# Altium schematic sheet Sheet2.1.SchDoc
size 508 x 254 mm
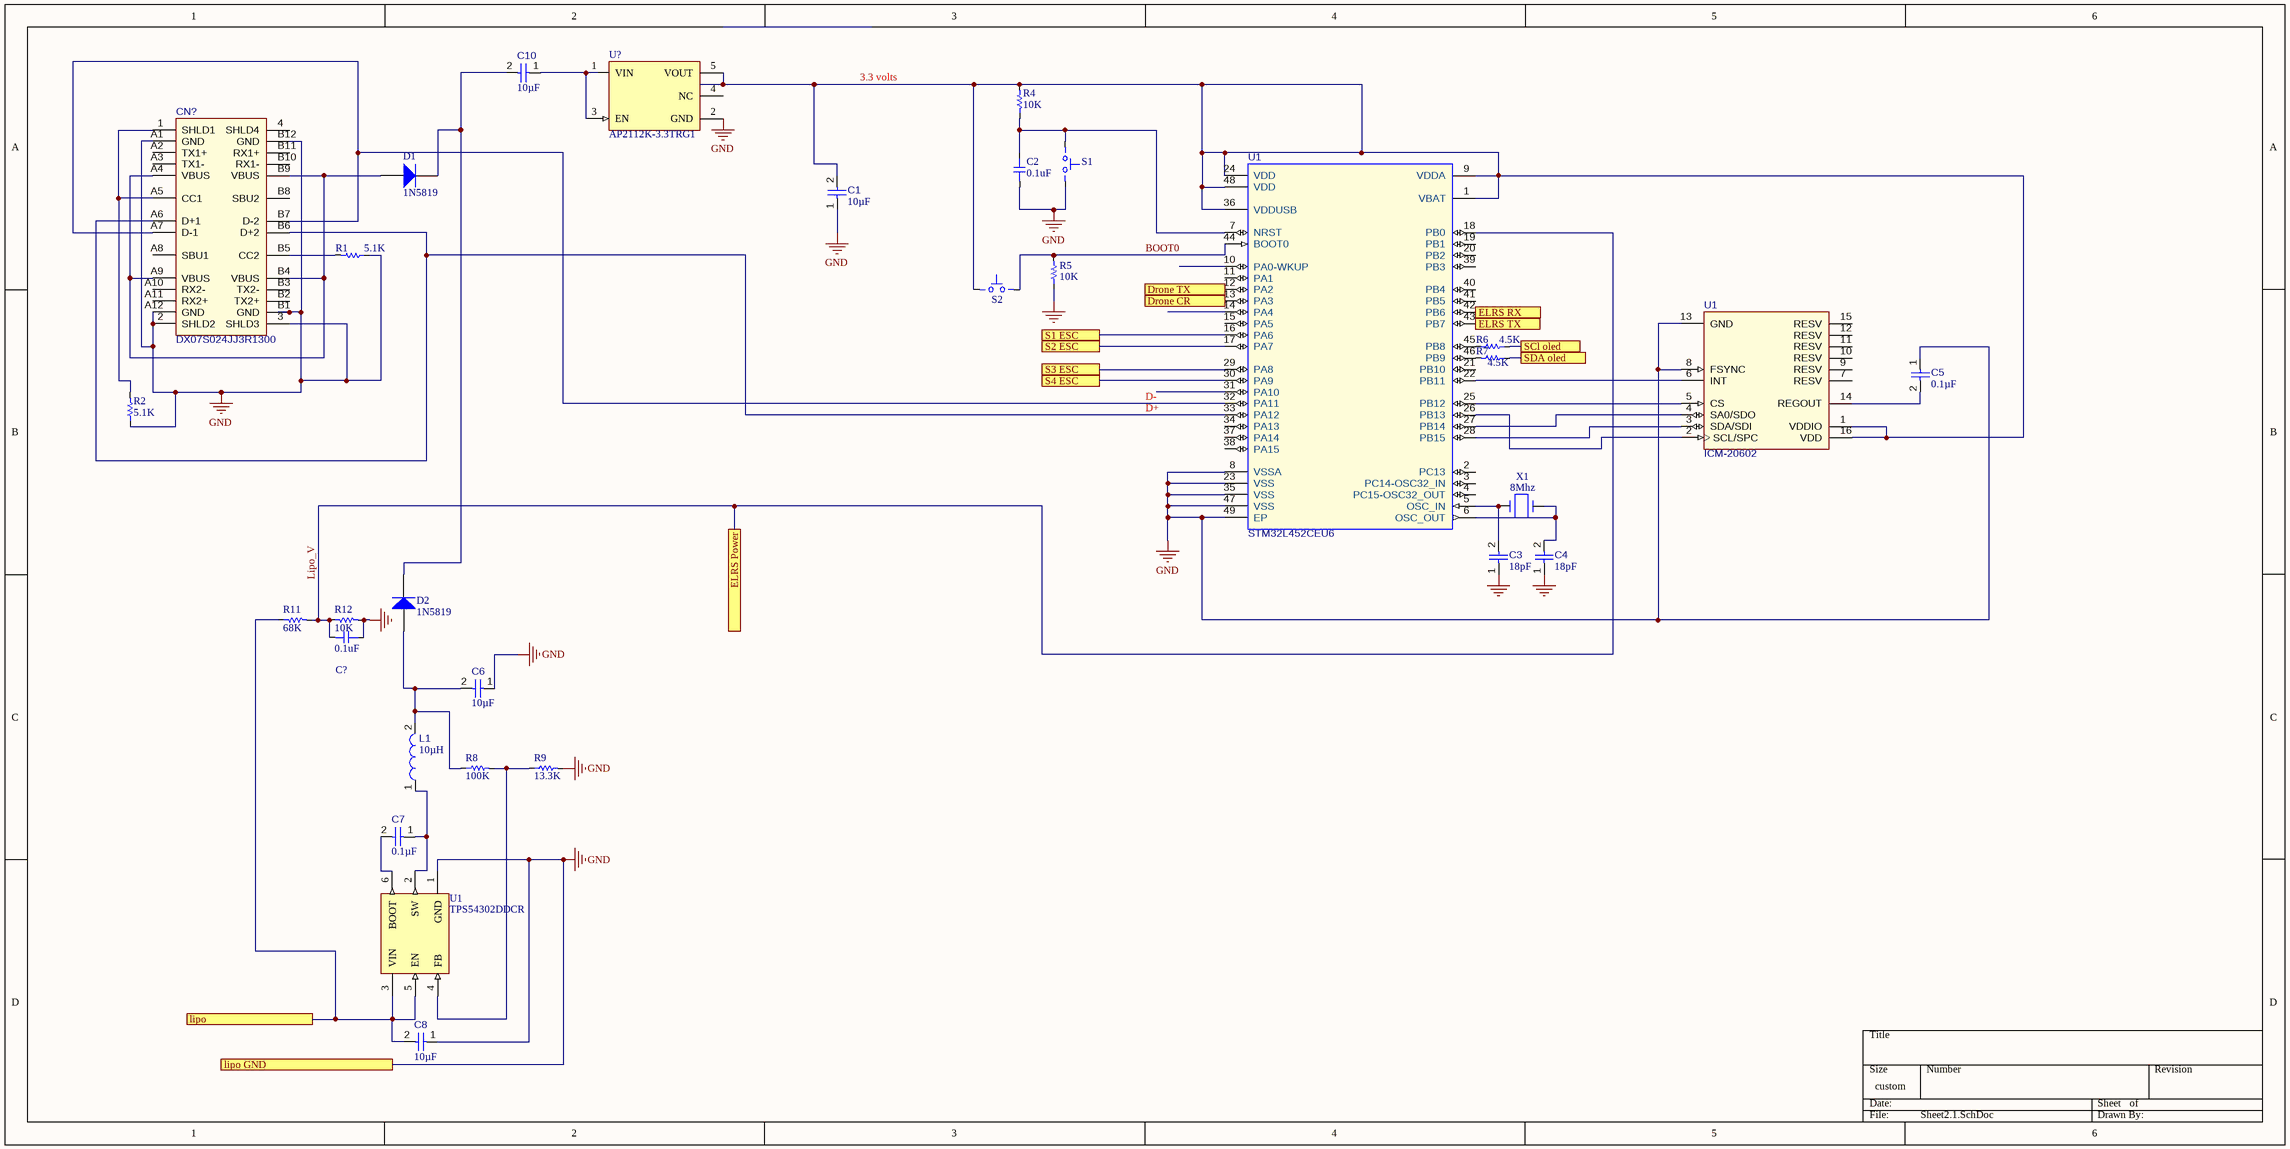
[diagram p0: Sheet2.1.SchDoc]

## Parts
(Parts that share a designator on the sheet are numbered #1, #2 ... from top to bottom, then left to right.)
C1  value 10µF  [CAPC0805(2012)145_L]  (hidden comment: Capacitor 10µF +/-20% 25V 0805)
C2  0.1uF  [CAPC1005X56N]
C3  value 18pF  [CAPC0805(2012)145_L]  (hidden comment: Capacitor 10µF +/-20% 25V 0805)
C4  value 18pF  [CAPC0805(2012)145_L]  (hidden comment: Capacitor 10µF +/-20% 25V 0805)
C5  value 0.1µF  [CAPC0805(2012)145_L]  (hidden comment: Capacitor 10µF +/-20% 25V 0805)
C6  value 10µF  [CAPC0805(2012)145_L]  (hidden comment: Capacitor 10µF +/-20% 25V 0805)
C7  value 0.1µF  [CAPC0805(2012)145_L]  (hidden comment: Capacitor 10µF +/-20% 25V 0805)
C8  value 10µF  [CAPC0805(2012)145_L]  (hidden comment: Capacitor 10µF +/-20% 25V 0805)
C10  value 10µF  [CAPC0805(2012)145_L]  (hidden comment: Capacitor 10µF +/-20% 25V 0805)
C?  0.1uF  [CAPC0603X56N]
CN?  DX07S024JJ3R1300  [JAE-DX07S024JJ3_V]
D1  1N5819  [ONSC-AXIAL_LEAD-2-59-10_P]
D2  1N5819  [ONSC-AXIAL_LEAD-2-59-10_P]
L1  value 10µH  [INDC2520X120X60NL20T20]  (hidden comment: LQM2HPN1R0MJ0L)
R1  5.1K  [RESC0603X40L (0201 footprint)]
R2  5.1K  [RESC0603X40L (0201 footprint)]
R4  10K  [RESC0603X40L (0201 footprint)]
R5  10K  [RESC0603X40L (0201 footprint)]
R6  4.5K  [RESC0603X40L (0201 footprint)]
R7  4.5K  [RESC0603X40L (0201 footprint)]
R8  100K  [RESC0603X40L (0201 footprint)]
R9  13.3K  [RESC0603X40L (0201 footprint)]
R11  68K  [RESC0603X40L (0201 footprint)]
R12  10K  [RESC0603X40L (0201 footprint)]
S1  (no value)  [TS-1088R-02526]
S2  (no value)  [TS-1088R-02526]
U1#1  STM32L452CEU6  [STM-UFQFPN48_N]
U1#2  ICM-20602  [INSE-I62-16]
U1#3  TPS54302DDCR  [FP-DDC0006A-MFG]
U?  AP2112K-3.3TRG1  [FP-SOT25-IPC_A]
X1  8Mhz  [TJXM32768K2TGDCNT2T]

## Ports
Drone CR, Drone TX, ELRS Power, ELRS RX, ELRS TX, lipo , lipo GND, S1 ESC, S2 ESC, S3 ESC, S4 ESC, SCl oled, SDA oled

## Nets
GND: C1.1 C2.1 C3.1 C4.1 C5.1 C6.1 C8.1 C?.2 CN?.2(SHLD2) CN?.3(SHLD3) CN?.A1(GND) CN?.A12(GND) CN?.B1(GND) CN?.B12(GND) R1.2 R2.2 R5.2 R9.1 R12.1 S1.1(A) U1#1.8(VSSA) U1#1.23(VSS) U1#1.35(VSS) U1#1.47(VSS) U1#1.49(EP) U1#2.8(FSYNC) U1#2.13(GND) U1#3.1(GND) U?.2(GND) ; port lipo GND
BOOT0: R5.1 S2.2(B) U1#1.44(BOOT0)
Drone CR: U1#1.13(PA3) ; port Drone CR
Drone TX: U1#1.12(PA2) ; port Drone TX
ELRS RX: U1#1.42(PB6) ; port ELRS RX
ELRS TX: U1#1.43(PB7) ; port ELRS TX
lipo : C8.2 R11.2 U1#3.3(VIN) U1#3.5(EN) ; port lipo 
Lipo_V: C?.1 R11.1 R12.2 U1#1.18(PB0) ; port ELRS Power
S1 ESC: U1#1.16(PA6) ; port S1 ESC
S2 ESC: U1#1.17(PA7) ; port S2 ESC
S3 ESC: U1#1.29(PA8) ; port S3 ESC
S4 ESC: U1#1.30(PA9) ; port S4 ESC
SCl oled: R6.2 ; port SCl oled
SDA oled: R7.2 ; port SDA oled
NetC1_2: C1.2 R4.1 S2.1(A) U1#1.1(VBAT) U1#1.9(VDDA) U1#1.24(VDD) U1#1.36(VDDUSB) U1#1.48(VDD) U1#2.1(VDDIO) U1#2.16(VDD) U?.5(VOUT)
NetC2_2: C2.2 R4.2 S1.2(B) U1#1.7(NRST)
NetC3_2: C3.2 U1#1.5(OSC_IN) X1.1
NetC4_2: C4.2 U1#1.6(OSC_OUT) X1.2
NetC5_2: C5.2 U1#2.14(REGOUT)
NetC6_2: C6.2 D2.1(A) L1.2 R8.2
NetC7_1: C7.1 L1.1 U1#3.2(SW)
NetC7_2: C7.2 U1#3.6(BOOT)
NetC10_1: C10.1 U?.1(VIN) U?.3(EN)
NetC10_2: C10.2 D1.2(K) D2.2(K)
NetCN?_1: CN?.1(SHLD1) CN?.A5(CC1) R2.1
NetCN?_A4: CN?.A4(VBUS) CN?.A9(VBUS) CN?.B4(VBUS) CN?.B9(VBUS) D1.1(A)
NetCN?_A6: CN?.A6(D+1) CN?.B6(D+2) U1#1.33(PA12)
NetCN?_A7: CN?.A7(D-1) CN?.B7(D-2) U1#1.32(PA11)
NetCN?_B5: CN?.B5(CC2) R1.1
NetR6_1: R6.1 U1#1.45(PB8)
NetR7_1: R7.1 U1#1.46(PB9)
NetR8_1: R8.1 R9.2 U1#3.4(FB)
NetU1#1_22: U1#1.22(PB11) U1#2.6(INT)
NetU1#1_25: U1#1.25(PB12) U1#2.5(CS)
NetU1#1_26: U1#1.26(PB13) U1#2.2(SCL/SPC)
NetU1#1_27: U1#1.27(PB14) U1#2.4(SA0/SDO)
NetU1#1_28: U1#1.28(PB15) U1#2.3(SDA/SDI)

Not connected (* = marked no-connect by the designer): CN? 4(SHLD4) A2(TX1+) A3(TX1-) A8(SBU1) A10(RX2-) A11(RX2+) B2(TX2+) B3(TX2-) B8(SBU2) B10(RX1-) B11(RX1+); U1#1 2(PC13) 3(PC14-OSC32_IN) 4(PC15-OSC32_OUT) 10(PA0-WKUP) 11(PA1) 14(PA4) 15(PA5) 19(PB1) 20(PB2) 21(PB10) 31(PA10) 34(PA13) 37(PA14) 38(PA15) 39(PB3) 40(PB4) 41(PB5); U1#2 7(RESV) 9(RESV) 10(RESV) 11(RESV) 12(RESV) 15(RESV); U? 4(NC)

## Notes on the sheet
- 3.3 volts
- D-
- D+

## Library data of the parts
C1 C3-C8 C10 = CMP-001-00079-4: Chip Capacitor, 10µF +/-20%, 25V, 0805, Thickness 1.45 mm; Tolerance: 10%; Max Operating Temperature: 85°C; Case/Package: 0805; Voltage Rating: 25V; Min Operating Temperature: -55°C; Mounting Technology: SMT; Pins: 2
C2 = CAP_0402: CAP 1uF 0402; Part_Footprint: 0402; Value: 0.1uF
C? = CAP_0201: CAP 0.1uF 0201; Part_Footprint: 0201; Value: 0.1uF
CN? = CMP-002-00065-3: USB-C Connector, 20 V, 1.25 A, -30 to 80 degC, RoHS, Tape and Reel; Gender: Receptacle; Pins: 28; Connector Type: USB-C
D1 D2 = CMP-004-00009-2: Low Drop Power Schottky Rectifier, 40 V, 1 A, 2-Pin DO-41, RoHS; Manufacturer: ON Semiconductor; Max Surge Current: 25A; Forward Current: 1A; Package Version: Rev. U, 02/2005; Peak Reverse Current: 1mA; Max Operating Temperature: 125°C; Case/Package: DO; Package URL: http://www.onsemi.cn/pub_link/Collateral/59-10.PDF; Packaging: Bulk; Manufacturer URL: http://www.onsemi.com/; Min Operating Temperature: -65°C; Package Description: 2-Pin, Axial Lead, Diameter 2.35 mm; Mounting Technology: TH; Datasheet URL: http://www.onsemi.cn/pub_link/Collateral/1N5817-D.PDF; Datasheet Version: Rev. 10, 07/2006; Package Reference: AXIAL_LEAD-2-59-10; Pins: 2; RoHS Compliant: True
L1 = CMP-006-00008-6: Chip Inductor, 1 uH, +/- 20%, 1 MHz, -55 to 125 degC, 1008 (2520 Metric), RoHS, Tape and Reel; Manufacturer: Murata; Self Resonant Frequency: 70MHz; Current Rating: 1.5A; Shielding: Shielded; Core Material: Ferrite; Resistance: 0.09Ohm; Datasheet URL: http://psearch.en.murata.com/inductor/product/LQM2HPN1R0MJ0%23.pdf; Datasheet Version: Aug-16; RoHS Compliant: True; Case/Package: 1008; Package Description: 2-Pin Surface Mount Device, Body 2.5 x 2 mm; Package Quantity: 3000; Tolerance: 20%; Min Operating Temperature: -40°C; Package Reference: 1008; Packaging: TapeandReel; Mounting Technology: SM; Max Operating Temperature: 85°C
R1 R2 R4 R6 R7 = RES_0201: RES 10 0201; PartFootprint: 0201
  R1 R2: Value: 5.1K
  R4: Value: 10K
  R6 R7: Value: 4.5K
R5 = RES_0201: RES 10K 0201; PartFootprint: 0201; Value: 10K
R8 R9 R11 = RES_0201: RES 390K 0201; PartFootprint: 0201
  R8: Value: 100K
  R9: Value: 13.3K
  R11: Value: 68K
R12 = RES_0201: RES 1M 0201; PartFootprint: 0201; Value: 10K
S1 S2 = TS-1088R-02526: Tactile Micro Switch; Part_Number: C455281; Manufacturer: XUNPU; Part_Footprint: SMD; Vendor: LCSC
U1#1 = CMP-020-00022-3: ARM® Cortex®-M4 STM32L4 Microcontroller IC 32-Bit 80MHz 512KB (512K x 8) FLASH 48-UFQFPN (7x7); I/Os: 38; RAM Size: 160; Min Supply Voltage: 2V; ComponentLink1URL: http://www.st.com/; ComponentLink2Description: Datasheet; Mounting Technology: Surface Mount; ComponentLink2URL: http://www.st.com/st-web-ui/static/active/en/resource/technical/document/datasheet/CD00161566.pdf; Case/Package: UFQFN-48; Pins: 49; RoHS Compliant: Yes; ComponentLink1Description: Manufacturer URL
U1#2 = CMP-010-00023-3: High Performance 6-Axis MEMS MotionTracking(TM) Device, 1.71 to 3.45 V, -40 to 85 degC, 16-Pin LGA, RoHS; Max Supply Voltage: 3.45V; Sensor Type: 6 Axis,Accelerometer,Gyroscope,Temperature; Min Supply Voltage: 1.71V; Mounting Technology: SMT; Max Operating Temperature: 85°C; Min Operating Temperature: -40°C; Pins: 16; Case/Package: LGA-16; RoHS Compliant: Yes
U1#3 = CMP-04918-000032-1: IC REG BUCK ADJ 3A TSOT23-6; Manufacturer: Texas Instruments; Output Voltage: 0.6-26V; Output Type: AdjustableProgrammable; Max Junction Temp: +125°C; Number Of Outputs: 1; Min Supply Voltage: 4.5V; Switching Frequency: 400kHz; Standoff Height: 0mm; Max Duty Cycle: 100%; Nominal Supply Current: 45uA; Max Supply Voltage: 28V; Temperature Range High: +125°C; Switching Topology: Buck; Device Class L2: Power Management ICs; Output Current: 3A; Automotive: No; Temperature Range Low: -40°C; Temperature: -40°C to +125°C; Height: 1.1mm; Ipc Land Pattern Name: SOT95P280X110-6; RoHS: TRUE; Digikey Description: IC REG BUCK ADJ 3A TSOT23-6; Manufacturer Part Number: TPS54302DDCR; ComponentLink2Description: Datasheet; Device Class L3: Voltage Regulators - Switching; Octopart: https://octopart.com/tps54302ddcr-texas+instruments-74209025; Device Class L1: Integrated Circuits (ICs); Lead Free: Yes; ComponentLink2URL: http://www.ti.com/lit/ds/symlink/tps54302.pdf; Category: IC; Package: DDC0006A
U? = CMP-12756-000035-1: IC REG LINEAR 3.3V 600MA SOT25; Number of Regulators: 1; Output Type: Fixed; Polarity: Positive; Min Input Voltage: 2.5V; Max Input Voltage: 6V; Accuracy: 1.5%; Quiescent Current: 55uA; Dropout Voltage: 250mV; Min Operating Temperature: -40°C; Length: 3.1mm; Output Current: 600mA; Max Operating Temperature: 85°C; Package Quantity: 1; Output Voltage: 3.3V; Width: 1.7mm; Number of Outputs: 1; Packaging: Tape and Reel; Height: 1.3mm; Lead Free: Lead Free; Max Output Current: 600mA; Case/Package: SOT-23-5; Mount: Surface Mount; Number of Pins: 5
X1 = TJXM32768K2TGDCNT2T: CRYSTAL 32.768 KHZ 12.5PF SMD; Manufacturer: TAE; Vendor: LCSC; Part_Number: TJXM32768K2TGDCNT2T; Value: 8Mhz